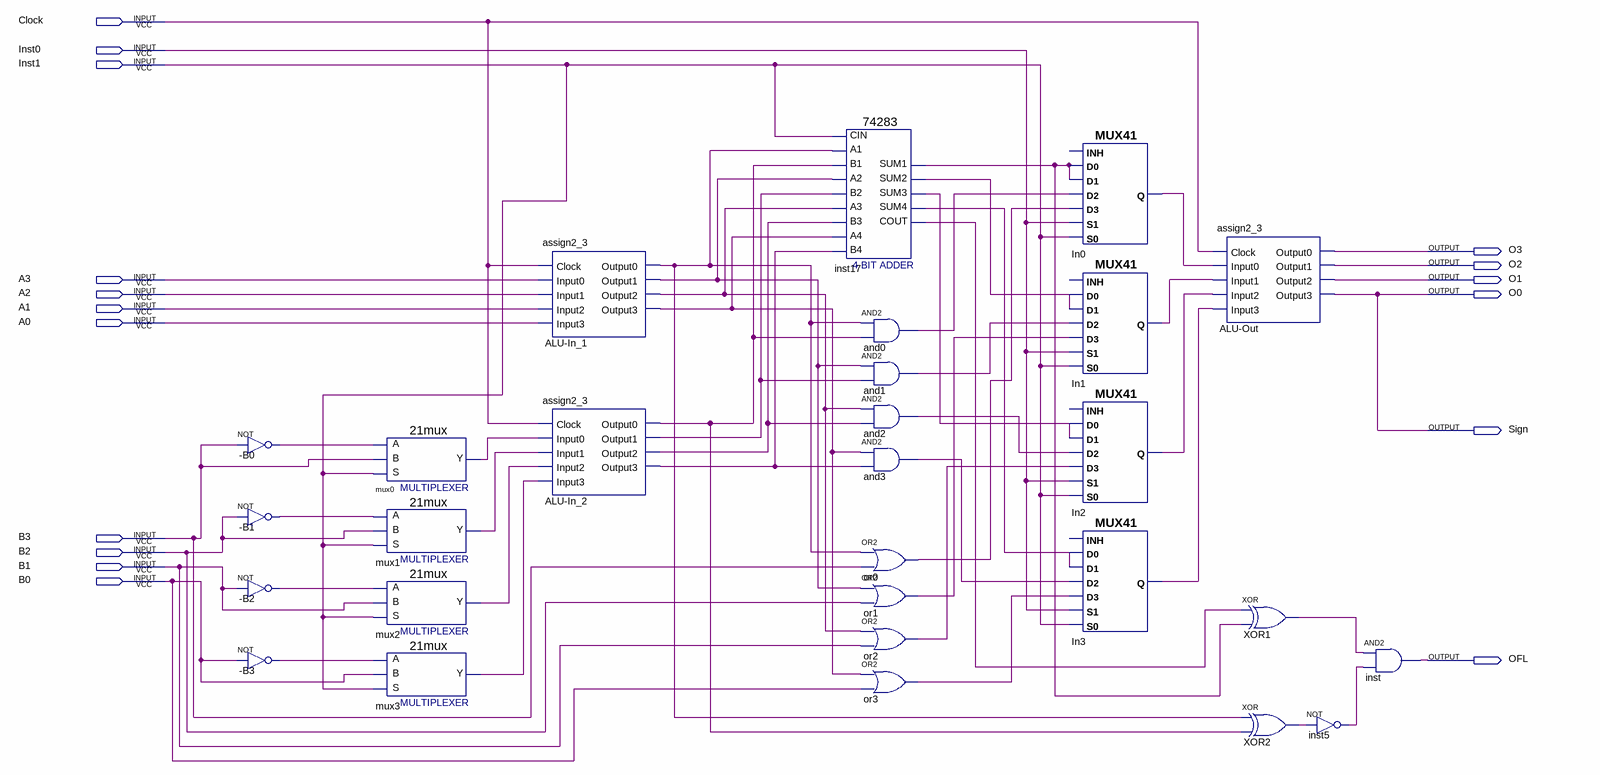
[diagram p0: schematic sheet]
// Quartus schematic ALU.bdf as structural Verilog: 28 symbols, 17 pins
module ALU (
  input  Clock,
  input  Inst0,
  input  Inst1,
  input  A3,
  input  A2,
  input  A1,
  input  A0,
  input  B3,
  input  B2,
  input  B1,
  input  B0,
  output O3,
  output O2,
  output O1,
  output O0,
  output Sign,
  output OFL
);

  wire _B0_out, _B1_out, _B2_out, _B3_out, ALU_In_1_output0, ALU_In_1_output1, ALU_In_1_output2,
       ALU_In_1_output3, ALU_In_2_output0, ALU_In_2_output1, ALU_In_2_output2, ALU_In_2_output3, and0_out,
       and1_out, and2_out, and3_out, In0_q, In1_q, In2_q, In3_q, inst5_out, inst17_cout, inst17_sum1,
       inst17_sum2, inst17_sum3, inst17_sum4, mux0_y, mux1_y, mux2_y, mux3_y, or0_out, or1_out, or2_out,
       or3_out, XOR1_out, XOR2_out;

  not \u_-B0  (_B0_out, B3);
  not \u_-B1  (_B1_out, B2);
  not \u_-B2  (_B2_out, B1);
  not \u_-B3  (_B3_out, B0);
  \21mux  mux0 (.S(Inst1), .B(B3), .A(_B0_out), .Y(mux0_y));
  \21mux  mux1 (.S(Inst1), .B(B2), .A(_B1_out), .Y(mux1_y));
  \21mux  mux2 (.S(Inst1), .B(B1), .A(_B2_out), .Y(mux2_y));
  \21mux  mux3 (.S(Inst1), .B(B0), .A(_B3_out), .Y(mux3_y));
  assign2_3 \ALU-In_1  (
    .Clock(Clock), .Input0(A3), .Input1(A2), .Input2(A1), .Input3(A0), .Output0(ALU_In_1_output0),
    .Output1(ALU_In_1_output1), .Output2(ALU_In_1_output2), .Output3(ALU_In_1_output3));
  assign2_3 \ALU-In_2  (
    .Clock(Clock), .Input0(mux0_y), .Input1(mux1_y), .Input2(mux2_y), .Input3(mux3_y),
    .Output0(ALU_In_2_output0), .Output1(ALU_In_2_output1), .Output2(ALU_In_2_output2),
    .Output3(ALU_In_2_output3));
  \74283  inst17 (
    .CIN(Inst1), .A1(ALU_In_1_output0), .A2(ALU_In_1_output1), .B2(ALU_In_2_output1), .A3(ALU_In_1_output2),
    .A4(ALU_In_1_output3), .B4(ALU_In_2_output3), .B1(ALU_In_2_output0), .B3(ALU_In_2_output2),
    .SUM4(inst17_sum4), .COUT(inst17_cout), .SUM1(inst17_sum1), .SUM2(inst17_sum2), .SUM3(inst17_sum3));
  and and0 (and0_out, ALU_In_1_output0, ALU_In_2_output0);
  and and1 (and1_out, ALU_In_1_output1, ALU_In_2_output1);
  and and2 (and2_out, ALU_In_1_output2, ALU_In_2_output2);
  and and3 (and3_out, ALU_In_1_output3, ALU_In_2_output3);
  or or0 (or0_out, ALU_In_1_output0, B3);
  or or1 (or1_out, ALU_In_1_output1, B2);
  or or2 (or2_out, ALU_In_1_output2, B1);
  or or3 (or3_out, ALU_In_1_output3, B0);
  MUX41 In0 (
    .S0(Inst1), .D2(and0_out), .S1(Inst0), .D3(or0_out), .D0(inst17_sum1), .D1(inst17_sum1), .Q(In0_q));  // open: INH
  MUX41 In1 (
    .S0(Inst1), .D2(and1_out), .S1(Inst0), .D3(or1_out), .D0(inst17_sum2), .D1(inst17_sum2), .Q(In1_q));  // open: INH
  MUX41 In2 (
    .S0(Inst1), .D2(and2_out), .S1(Inst0), .D3(or2_out), .D0(inst17_sum3), .D1(inst17_sum3), .Q(In2_q));  // open: INH
  MUX41 In3 (
    .S0(Inst1), .D2(and3_out), .S1(Inst0), .D3(or3_out), .D0(inst17_sum4), .D1(inst17_sum4), .Q(In3_q));  // open: INH
  assign2_3 \ALU-Out  (
    .Clock(Clock), .Input0(In0_q), .Input1(In1_q), .Input2(In2_q), .Input3(In3_q), .Output0(O3),
    .Output1(O2), .Output2(O1), .Output3(O0));
  xor XOR1 (XOR1_out, inst17_cout, inst17_sum1);
  xor XOR2 (XOR2_out, ALU_In_1_output0, ALU_In_2_output0);
  not inst5 (inst5_out, XOR2_out);
  and inst (OFL, XOR1_out, inst5_out);

  assign Sign = O0;
endmodule
